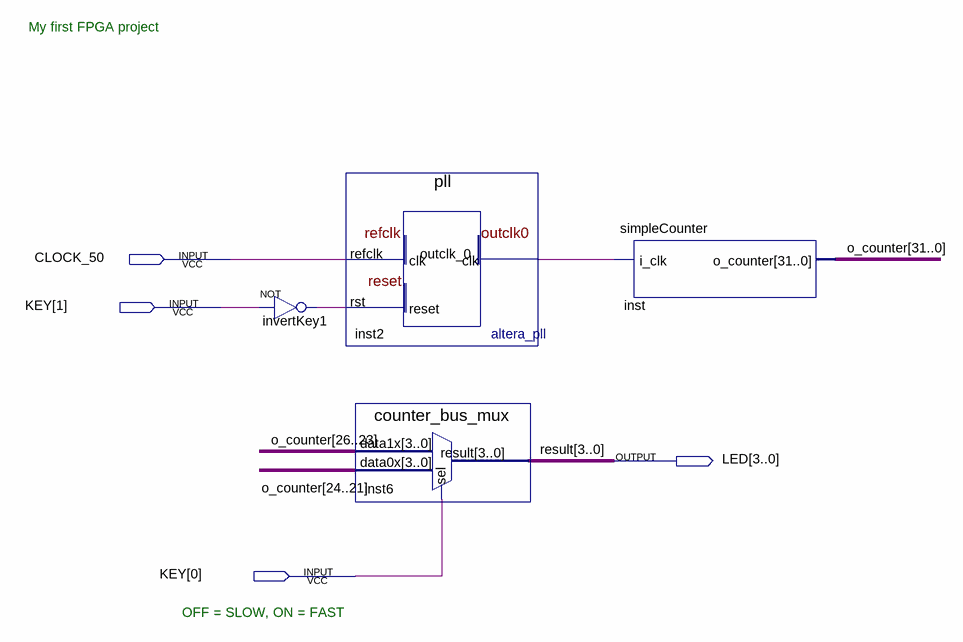
[diagram p0: schematic sheet]
// Quartus schematic my_first_fpga.bdf as structural Verilog: 4 symbols, 4 pins
module my_first_fpga (
  input  CLOCK_50,
  input  [1:0] KEY,
  output [3:0] LED
);

  wire inst2_outclk_0, invertKey1_out;
  wire [31:0] o_counter;

  not invertKey1 (invertKey1_out, KEY[1]);
  pll inst2 (.refclk(CLOCK_50), .rst(invertKey1_out), .outclk_0(inst2_outclk_0));
  counter_bus_mux inst6 (.data1x(o_counter[26:23]), .data0x(o_counter[24:21]), .sel(KEY[0]), .result(LED));
  simpleCounter inst (.i_clk(inst2_outclk_0), .o_counter(o_counter));

  // Other names for the same wires on the sheet: result[3:0] = LED

  // Notes on the sheet:
  //   My first FPGA project
  //   OFF = SLOW, ON = FAST
endmodule
